# EAGLE schematic main (EAGLE 5.11)
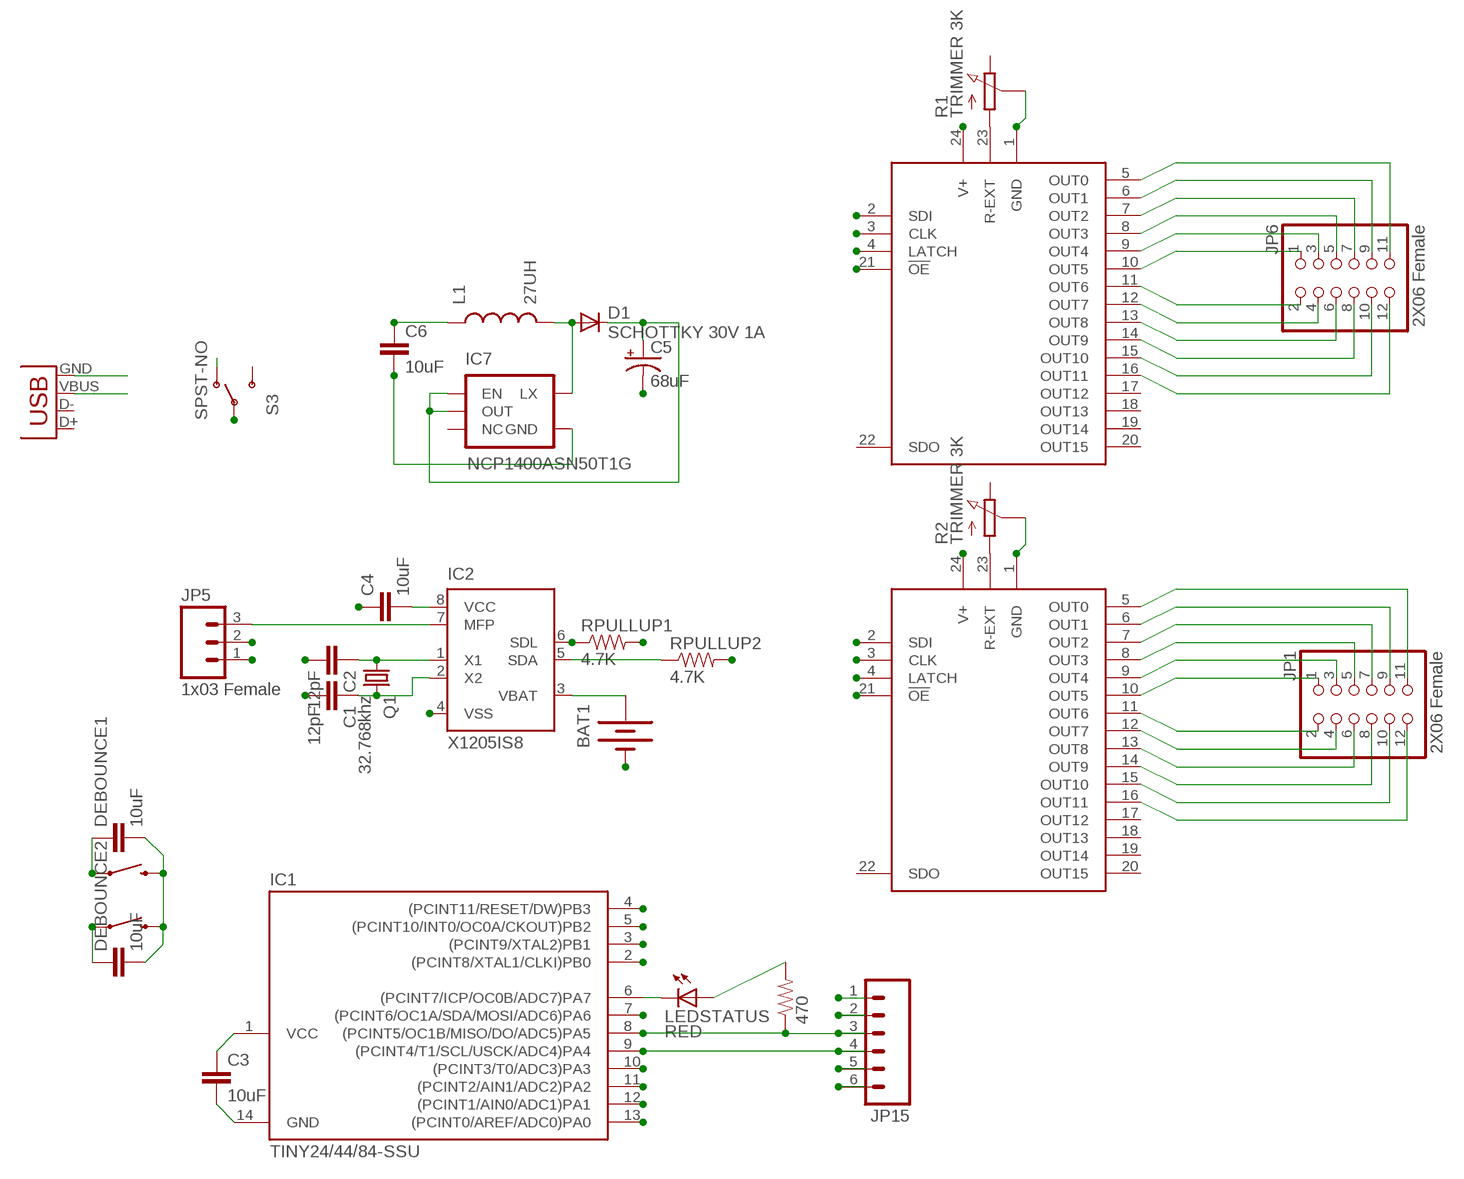
[diagram p0: schematic, sheet 1]

## Parts
BAT1  BATTERY12MM  [BATTCON_12MM]
C1  12pF  CAP0805  [0805]
C2  12pF  CAP0805  [0805]
C3  10uF  CAP0805  [0805]
C4  10uF  CAP0805  [0805]
C5  68uF  CAP_POL3528-KIT  [EIA3528-KIT]
C6  10uF  CAP0805  [0805]
D1  SCHOTTKY 30V 1A  DIODE-SOD80C  [SOD80C]
DEBOUNCE1  10uF  CAP0805  [0805]
DEBOUNCE2  10uF  CAP0805  [0805]
IC1  TINY24/44/84-SSU  [SOIC14]
IC2  X1205IS8  [SO-08]
IC3  TLC5925  TLC5925I  [SO24L]
IC4  TLC5925  TLC5925I  [SO24L]
IC7  NCP1400ASN50T1G  V_REG_NCP1400SOT23-5  [SOT23-5]
JP1  2X06 Female  PINHD-2X6  [2X06]
JP5  1x03 Female  M031X03_NO_SILK  [1X03_NO_SILK]
JP6  2X06 Female  PINHD-2X6  [2X06]
JP15  M06SMD  [1X06-SMD]
L1  27UH  INDUCTOR-B82462G  [B82462G]
LEDSTATUS  RED  LEDCHIPLED_0805  [CHIPLED_0805]
Q1  32.768khz  MC-306  [MC-306]
R1  TRIMMER 3K  PC25PVZ2A  [PC25]
R2  TRIMMER 3K  PC25PVZ2A  [PC25]
RPULLUP1  4.7K  RESISTOR0805-RES  [0805]
RPULLUP2  4.7K  RESISTOR0805-RES  [0805]
RSTATUS  470  RESISTOR0805-RES  [0805]
S1  SWITCH-MOMENTARY-2-SMD-1101NE  [TACTILE-SWITCH-1101NE]
S2  SWITCH-MOMENTARY-2-SMD-1101NE  [TACTILE-SWITCH-1101NE]
S3  SPST-NO  SWITCH-SPST-SMD-A  [SWITCH-SPST-SMD-A]
X1  USB-MICROB  [USB-MICROB]

## Nets
1HZ: IC1.12((PCINT1/AIN0/ADC1)PA1) IC2.7(MFP) JP5.3
BATBACKUP: BAT1.PWR@1(+) IC2.3(VBAT)
FF: DEBOUNCE2.1 IC1.3((PCINT9/XTAL2)PB1) S2.P$1
GND: BAT1.GND(-) C1.2 C2.2 C3.2 C4.1 C5.C(-) C6.2 DEBOUNCE1.2 DEBOUNCE2.2 IC1.14(GND) IC2.4(VSS) IC3.1(GND) IC4.1(GND) IC7.4(GND) JP15.1 R1.2(WIPER) R2.2(WIPER) S1.P$2 S2.P$2 X1.GND
HOURCLOCK: IC1.11((PCINT2/AIN1/ADC2)PA2) IC4.3(CLK)
MINUTECLOCK: IC1.13((PCINT0/AREF/ADC0)PA0) IC3.3(CLK)
MISO: IC1.8((PCINT5/OC1B/MISO/DO/ADC5)PA5) JP15.3 RSTATUS.1
N$1: D1.A IC7.5(LX) L1.P$2
N$2: IC3.5(OUT0) JP6.11
N$3: IC3.6(OUT1) JP6.9
N$4: C2.1 IC2.1(X1) Q1.1
N$5: IC3.7(OUT2) JP6.7
N$6: IC3.8(OUT3) JP6.5
N$7: IC3.9(OUT4) JP6.3
N$12: IC3.10(OUT5) JP6.1
N$13: IC3.11(OUT6) JP6.2
N$14: IC3.12(OUT7) JP6.4
N$15: IC3.13(OUT8) JP6.6
N$17: IC3.14(OUT9) JP6.8
N$18: IC3.15(OUT10) JP6.10
N$19: IC3.16(OUT11) JP6.12
N$20: IC4.5(OUT0) JP1.11
N$21: IC4.6(OUT1) JP1.9
N$22: IC4.7(OUT2) JP1.7
N$23: IC4.8(OUT3) JP1.5
N$24: IC4.9(OUT4) JP1.3
N$25: IC4.10(OUT5) JP1.1
N$26: IC4.11(OUT6) JP1.2
N$27: IC4.12(OUT7) JP1.4
N$28: IC4.13(OUT8) JP1.6
N$29: IC4.14(OUT9) JP1.8
N$30: IC4.15(OUT10) JP1.10
N$31: IC4.16(OUT11) JP1.12
N$56: IC3.23(R-EXT) R1.1(VCC)
N$57: C1.1 IC2.2(X2) Q1.4
N$58: IC1.6((PCINT7/ICP/OC0B/ADC7)PA7) LEDSTATUS.C
N$59: LEDSTATUS.A RSTATUS.2
N$60: S3.1(O)
N$62: IC4.23(R-EXT) R2.1(VCC)
OE: IC1.5((PCINT10/INT0/OC0A/CKOUT)PB2) IC3.21(!OE) IC4.21(!OE)
RESET: IC1.4((PCINT11/RESET/DW)PB3) JP15.5
RW: DEBOUNCE1.1 IC1.2((PCINT8/XTAL1/CLKI)PB0) S1.P$1
SCL: IC1.9((PCINT4/T1/SCL/USCK/ADC4)PA4) IC2.6(SDL) JP15.4 RPULLUP1.1
SDA: IC1.7((PCINT6/OC1A/SDA/MOSI/ADC6)PA6) IC2.5(SDA) JP15.6 RPULLUP2.1
SERIALOUT: IC1.10((PCINT3/T0/ADC3)PA3) IC3.2(SDI) IC4.2(SDI)
VCC: C5.A(+) D1.C IC7.1(EN) IC7.2(OUT) JP5.2
VRAWSWITCHED: C3.1 C4.2 C6.1 IC1.1(VCC) IC2.8(VCC) IC3.4(LATCH) IC3.24(V+) IC4.4(LATCH) IC4.24(V+) JP5.1 JP15.2 L1.P$1 RPULLUP1.2 RPULLUP2.2 S3.2(P)
VUSB: X1.VBUS
Unconnected: IC3.17(OUT12) IC3.18(OUT13) IC3.19(OUT14) IC3.20(OUT15) IC3.22(SDO) IC4.17(OUT12) IC4.18(OUT13) IC4.19(OUT14) IC4.20(OUT15) IC4.22(SDO) IC7.3(NC) R1.3(GND) R2.3(GND) S3.3(S) X1.D+ X1.D-

## Library data of the parts
BAT1 = SparkFun:BATTERY: Battery Holders Various common sizes : AA, AAA, 20mm coin cell and 12mm coin cell.
C1-C4 C6 DEBOUNCE1 DEBOUNCE2 = SparkFun:CAP: Capacitor Standard 0603 ceramic capacitor, and 0.1" leaded capacitor.
C5 = SparkFun:CAP_POL: Capacitor Polarized These are standard SMD and PTH capacitors. Normally 10uF, 47uF, and 100uF in electrolytic and tantalum varieties. Always verify the external diameter of the through hole cap, it varies with capacity, voltage, and manufacturer. The EIA devices should be standard.
D1 = diode:DIODE-: DIODE
IC1 = avr-7:TINY24/44/84
IC2 = RyanK:X1205*: 2-Wire RTC Real Time Clock/Calendar; OC_FARNELL: unknown; OC_NEWARK: unknown
IC3 IC4 = RyanK:TLC5925I: TCL5925i
IC7 = SparkFun:V_REG_NCP1400: Switching step-up voltage regulator NCP1400 switiching regulator takes single cell AA and outputs 100mA at 3.3V or 5V with minimal number of external components.
JP1 JP6 = RyanK:PINHD-2X6: PIN HEADER
JP5 = SparkFun:M03: Header 3 Standard 3-pin 0.1" header. Use with straight break away headers (SKU : PRT-00116), right angle break away headers (PRT-00553), swiss pins (PRT-00743), machine pins (PRT-00117), and female headers (PRT-00115). Molex polarized connector foot print use with SKU : PRT-08232 with associated crimp pins and housings.
JP15 = RyanK:M06: Header 6 Standard 6-pin 0.1" header. Use with straight break away headers (SKU : PRT-00116), right angle break away headers (PRT-00553), swiss pins (PRT-00743), machine pins (PRT-00117), and female headers (PRT-00115). Molex polarized connector foot print use with SKU : PRT-08094 with associated crimp pins and housings. NOTES ON THE VARIANTS LOCK and LOCK_LONGPADS... This footprint was designed to help hold the alignment of a through-hole component (i.e. 6-pin header) while soldering it into place. You may notice that each hole has been shifted either up or down by 0.005 of an inch from it's more standard position (which is a perfectly straight line). This slight alteration caused the pins (the squares in the middle) to touch the edges of the holes. Because they are alternating, it causes a "brace" to hold the component in place. 0.005 has proven to be the perfect amount of "off-center" position when using our standard breakaway headers. Although looks a little odd when you look at the bare footprint, once you have a header in there, the alteration is very hard to notice. Also, if you push a header all the way into place, it is covered up entirely on the bottom side. This idea of altering the position of holes to aid alignment will be further integrated into the Sparkfun Library for other footprints. It can help hold any component with 3 or more connection pins.
L1 = SparkFun:INDUCTOR: Inductors Basic Inductor/Choke - 0603 and 1206. Footprints are not proven and vary greatly between part numbers.
LEDSTATUS = led:LED: LED OSRAM: - CHIPLED LG R971, LG N971, LY N971, LG Q971, LY Q971, LO R971, LY R971 LH N974, LH R974 LS Q976, LO Q976, LY Q976 LO Q996 - Hyper CHIPLED LW Q18S LB Q993, LB Q99A, LB R99A - SideLED LS A670, LO A670, LY A670, LG A670, LP A670 LB A673, LV A673, LT A673, LW A673 LH A674 LY A675 LS A676, LA A676, LO A676, LY A676, LW A676 LS A679, LY A679, LG A679 - Hyper Micro SIDELED® LS Y876, LA Y876, LO Y876, LY Y876 LT Y87S - SmartLED LW L88C, LW L88S LB L89C, LB L89S, LG L890 LS L89K, LO L89K, LY L89K LS L896, LA L896, LO L896, LY L896 - TOPLED LS T670, LO T670, LY T670, LG T670, LP T670 LSG T670, LSP T670, LSY T670, LOP T670, LYG T670 LG T671, LOG T671, LSG T671 LB T673, LV T673, LT T673, LW T673 LH T674 LS T676, LA T676, LO T676, LY T676, LB T676, LH T676, LSB T676, LW T676 LB T67C, LV T67C, LT T67C, LS T67K, LO T67K, LY T67K, LW E67C LS E67B, LA E67B, LO E67B, LY E67B, LB E67C, LV E67C, LT E67C LW T67C LS T679, LY T679, LG T679 LS T770, LO T770, LY T770, LG T770, LP T770 LB T773, LV T773, LT T773, LW T773 LH T774 LS E675, LA E675, LY E675, LS T675 LS T776, LA T776, LO T776, LY T776, LB T776 LHGB T686 LT T68C, LB T68C - Hyper Mini TOPLED® LB M676 - Mini TOPLED Santana® LG M470 LS M47K, LO M47K, LY M47K Source: http://www.osram.convergy.de LUXEON: - LUMILED® LXK2-PW12-R00, LXK2-PW12-S00, LXK2-PW14-U00, LXK2-PW14-V00 LXK2-PM12-R00, LXK2-PM12-S00, LXK2-PM14-U00 LXK2-PE12-Q00, LXK2-PE12-R00, LXK2-PE12-S00, LXK2-PE14-T00, LXK2-PE14-U00 LXK2-PB12-K00, LXK2-PB12-L00, LXK2-PB12-M00, LXK2-PB14-N00, LXK2-PB14-P00, LXK2-PB14-Q00 LXK2-PR12-L00, LXK2-PR12-M00, LXK2-PR14-Q00, LXK2-PR14-R00 LXK2-PD12-Q00, LXK2-PD12-R00, LXK2-PD12-S00 LXK2-PH12-R00, LXK2-PH12-S00 LXK2-PL12-P00, LXK2-PL12-Q00, LXK2-PL12-R00 Source: www.luxeon.com KINGBRIGHT: KA-3528ASYC Source: www.kingbright.com
Q1 = crystal:MC-306: kHz RANGE CRYSTAL UNIT SMD Source: MC-306_405_406_E07X.PDF Homepage <www.epsontoyocom.co.jp>; MPN: MC-306 60.0KHZ 100PPM ,12.5PF; OC_FARNELL: 1278040; OC_NEWARK: 31M5576
R1 R2 = RyanK:PC25: VITROHM POTENTIOMETER
RPULLUP1 RPULLUP2 RSTATUS = SparkFun:RESISTOR: Resistor Basic schematic elements and footprints for 0603, 1206, and PTH resistors.
S1 S2 = SparkFun:SWITCH-MOMENTARY-2
S3 = SparkFun:SWITCH-SPST: SPST Switch Simple slide switch. Spark Fun Electronics SKU : COM-00102
X1 = SparkFun:USB: USB Connectors USB-B-PTH is fully proven SKU : PRT-00139 USB-miniB is fully proven SKU : PRT-00587 USB-A-PCB is untested. USB-A-H is throughly reviewed, but untested. Spark Fun Electronics SKU : PRT-00437 USB-B-SMT is throughly reviewed, but untested. Needs silkscreen touching up. USB-A-S has not been used/tested USB-MB-H has not been used/tested